# EAGLE design MA_board_1 (EAGLE 9.4.2)
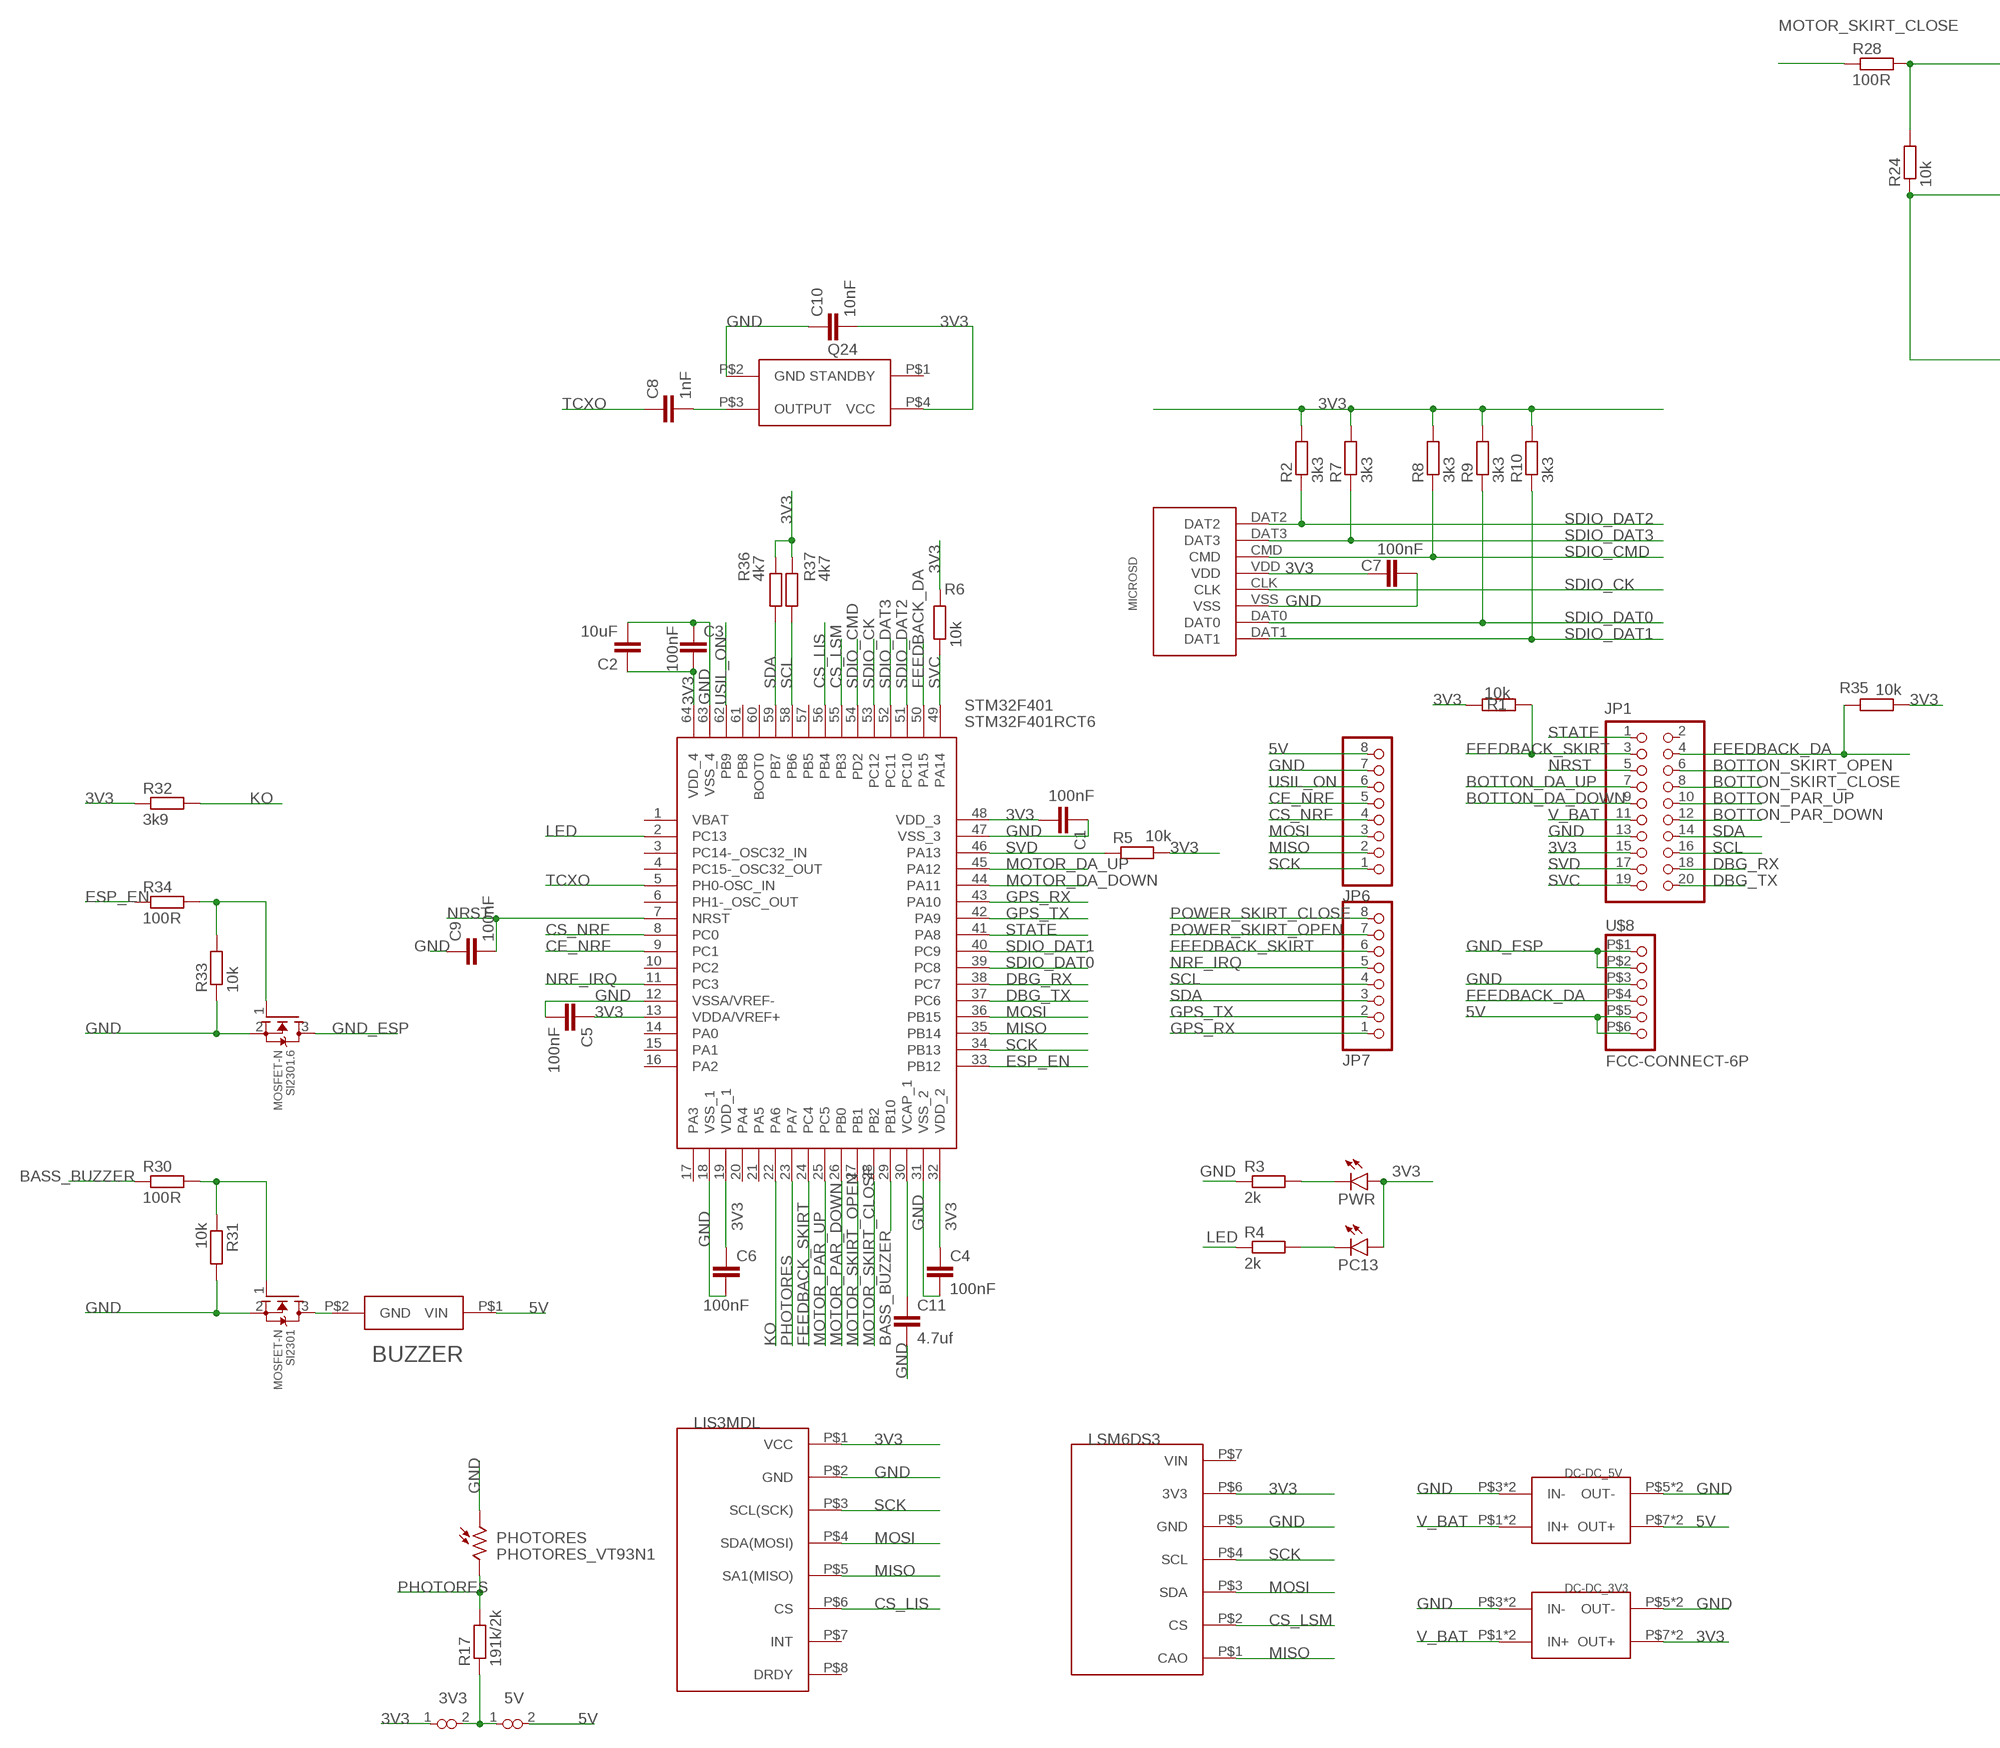
[diagram p0: schematic, sheet 1, part 1 of 2]
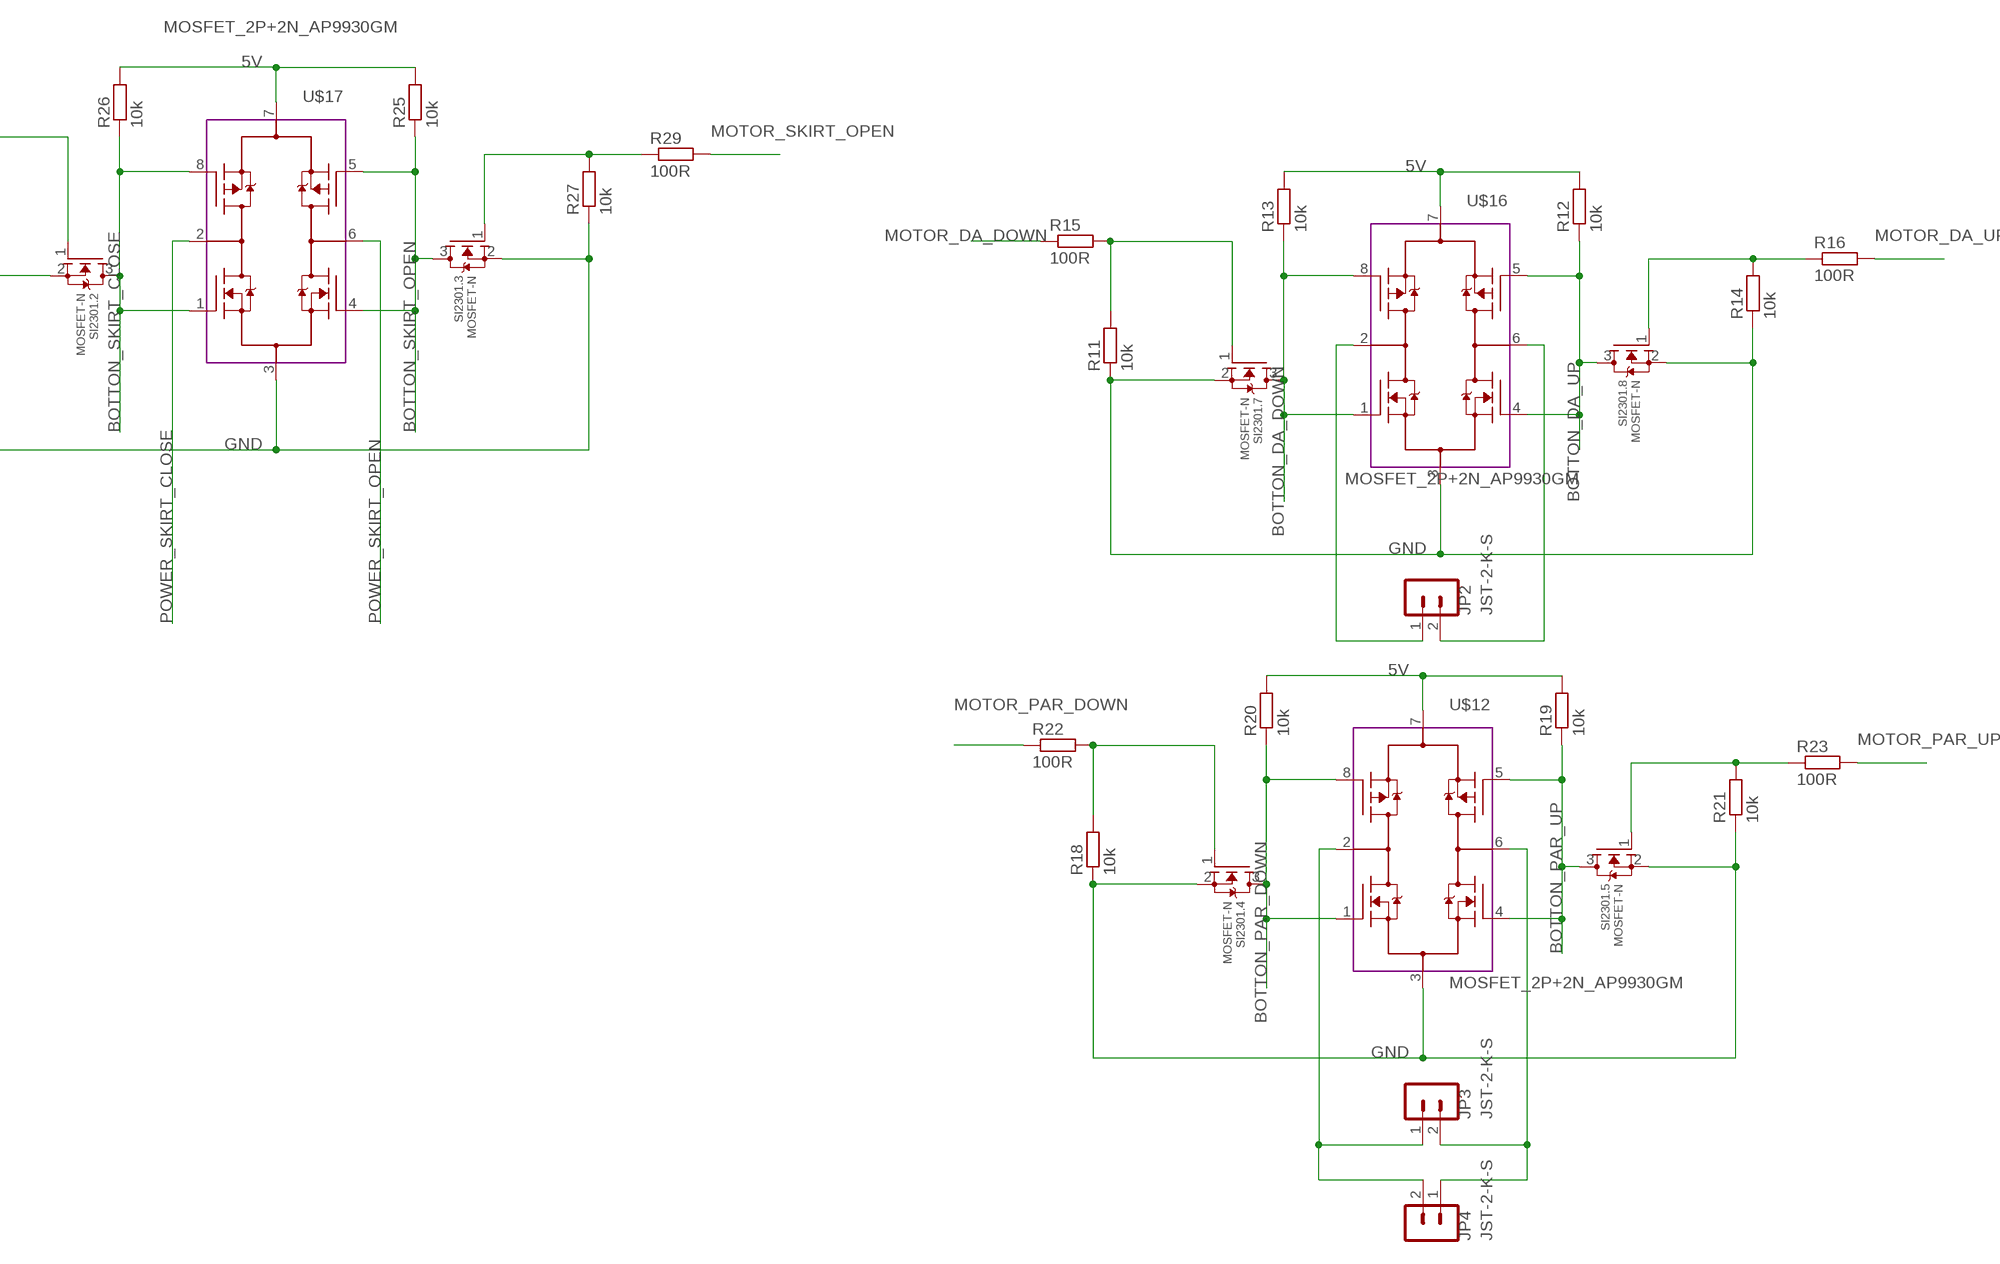
[diagram p1: schematic, sheet 1, part 2 of 2]

## Parts
3V3  VIAS-CONNECT  [VIAS-CONNECT]
5V  VIAS-CONNECT  [VIAS-CONNECT]
BUZZER  BUZZERS8R6  [BUZZER-S8R12]
C1  100nF  C-EUC0603  [C0603]
C2  10uF  C-EUC1206  [C1206]
C3  100nF  C-EUC0603  [C0603]
C4  100nF  C-EUC0603  [C0603]
C5  100nF  C-EUC0603  [C0603]
C6  100nF  C-EUC0603  [C0603]
C7  100nF  C-EUC0603  [C0603]
C8  1nF  C-EUC0603  [C0603]
C9  100nF  C-EUC0603  [C0603]
C10  10nF  C-EUC0603  [C0603]
C11  4.7uf  C-EUC0603  [C0603]
DC-DC_3V3  MP1584-B  [MP1584-B]
DC-DC_5V  MP1584-B  [MP1584-B]
JP1  PINHD-2X10/90  [2X10/90]
JP2  JST-2-K-S  [B2B-PH-K-S]
JP3  JST-2-K-S  [B2B-PH-K-S]
JP4  JST-2-K-S  [B2B-PH-K-S]
JP6  PINHD-1X8-SHORT-PAD  [1X08]
JP7  PINHD-1X8-SHORT-PAD  [1X08]
LIS3MDL  LIS3MDL-CJMCUБез_отв._зеркальный  [LIS3MDL-CGMSU-NB2023]
LSM6DS3  LSM6DS3-GY-NB2023  [LSM6DS3-GY-NB2023]
MICROSD  SD  [SD]
PC13  LEDCHIPLED_0603  [CHIPLED_0603]
PHOTORES  PHOTORES_VT93N1  [PHOTORES_VT93N1_SMD]
PWR  LEDCHIPLED_0603  [CHIPLED_0603]
Q24  Q24  [Q24]
R1  10k  R-EU_R0603  [R0603]
R2  3k3  R-EU_R0603  [R0603]
R3  2k  R-EU_R0603  [R0603]
R4  2k  R-EU_R0603  [R0603]
R5  10k  R-EU_R0603  [R0603]
R6  10k  R-EU_R0603  [R0603]
R7  3k3  R-EU_R0603  [R0603]
R8  3k3  R-EU_R0603  [R0603]
R9  3k3  R-EU_R0603  [R0603]
R10  3k3  R-EU_R0603  [R0603]
R11  10k  R-EU_R0603  [R0603]
R12  10k  R-EU_R0603  [R0603]
R13  10k  R-EU_R0603  [R0603]
R14  10k  R-EU_R0603  [R0603]
R15  100R  R-EU_R0603  [R0603]
R16  100R  R-EU_R0603  [R0603]
R17  191k/2k  R-EU_R0603  [R0603]
R18  10k  R-EU_R0603  [R0603]
R19  10k  R-EU_R0603  [R0603]
R20  10k  R-EU_R0603  [R0603]
R21  10k  R-EU_R0603  [R0603]
R22  100R  R-EU_R0603  [R0603]
R23  100R  R-EU_R0603  [R0603]
R24  10k  R-EU_R0603  [R0603]
R25  10k  R-EU_R0603  [R0603]
R26  10k  R-EU_R0603  [R0603]
R27  10k  R-EU_R0603  [R0603]
R28  100R  R-EU_R0603  [R0603]
R29  100R  R-EU_R0603  [R0603]
R30  100R  R-EU_R0603  [R0603]
R31  10k  R-EU_R0603  [R0603]
R32  3k9  R-EU_R0603  [R0603]
R33  10k  R-EU_R0603  [R0603]
R34  100R  R-EU_R0603  [R0603]
R35  10k  R-EU_R0603  [R0603]
R36  4k7  R-EU_R0603  [R0603]
R37  4k7  R-EU_R0603  [R0603]
SI2301  MOSFET-N  [SOT23-3]
SI2301.2  MOSFET-N  [SOT23-3]
SI2301.3  MOSFET-N  [SOT23-3]
SI2301.4  MOSFET-N  [SOT23-3]
SI2301.5  MOSFET-N  [SOT23-3]
SI2301.6  MOSFET-N  [SOT23-3]
SI2301.7  MOSFET-N  [SOT23-3]
SI2301.8  MOSFET-N  [SOT23-3]
STM32F401  STM32F401RCT6  [QFP50P1200X1200X160-64N]
U$8  FCC-CONNECT-6P  [FFC-CONNECT-6P-SMD]
U$12  MOSFET_2P+2N_AP9930GM  [SO8]
U$16  MOSFET_2P+2N_AP9930GM  [SO8]
U$17  MOSFET_2P+2N_AP9930GM  [SO8]

## Nets
3V3: 3V3.1 C1.2 C2.1 C3.2 C4.1 C5.1 C6.1 C7.2 C10.2 DC-DC_3V3.P$7(OUT+) DC-DC_3V3.P$8(OUT+) JP1.15 LIS3MDL.P$1(VCC) LSM6DS3.P$6(3V3) MICROSD.VDD PC13.A PWR.A Q24.P$4(VCC) R1.2 R2.2 R5.2 R6.2 R7.2 R8.2 R9.2 R10.2 R32.1 R35.1 R36.2 R37.2 STM32F401.13(VDDA/VREF+) STM32F401.19(VDD_1) STM32F401.32(VDD_2) STM32F401.48(VDD_3) STM32F401.64(VDD_4)
5V: 5V.2 BUZZER.P$1(VIN) DC-DC_5V.P$7(OUT+) DC-DC_5V.P$8(OUT+) JP6.8 R12.2 R13.2 R19.2 R20.2 R25.2 R26.2 U$8.P$5 U$8.P$6 U$12.7(P1P2S) U$16.7(P1P2S) U$17.7(P1P2S)
BASS_BUZZER: R30.1 STM32F401.29(PB10)
BOTTON_DA_DOWN: JP1.9 R13.1 SI2301.7.3(D) U$16.1(N1G) U$16.8(P1G)
BOTTON_DA_UP: JP1.7 R12.1 SI2301.8.3(D) U$16.4(N2G) U$16.5(P2G)
BOTTON_PAR_DOWN: JP1.12 R20.1 SI2301.4.3(D) U$12.1(N1G) U$12.8(P1G)
BOTTON_PAR_UP: JP1.10 R19.1 SI2301.5.3(D) U$12.4(N2G) U$12.5(P2G)
BOTTON_SKIRT_CLOSE: JP1.8 R26.1 SI2301.2.3(D) U$17.1(N1G) U$17.8(P1G)
BOTTON_SKIRT_OPEN: JP1.6 R25.1 SI2301.3.3(D) U$17.4(N2G) U$17.5(P2G)
CE_NRF: JP6.5 STM32F401.9(PC1)
CS_LIS: LIS3MDL.P$6(CS) STM32F401.56(PB4)
CS_LSM: LSM6DS3.P$2(CS) STM32F401.55(PB3)
CS_NRF: JP6.4 STM32F401.8(PC0)
DBG_RX: JP1.18 STM32F401.38(PC7)
DBG_TX: JP1.20 STM32F401.37(PC6)
ESP_EN: R34.1 STM32F401.33(PB12)
FEEDBACK_DA: JP1.4 R35.2 STM32F401.50(PA15) U$8.P$4
FEEDBACK_SKIRT: JP1.3 JP7.6 R1.1 STM32F401.24(PC4)
GND: C1.1 C2.2 C3.1 C4.2 C5.2 C6.2 C7.1 C9.1 C10.1 C11.2 DC-DC_3V3.P$3(IN-) DC-DC_3V3.P$4(IN-) DC-DC_3V3.P$5(OUT-) DC-DC_3V3.P$6(OUT-) DC-DC_5V.P$3(IN-) DC-DC_5V.P$4(IN-) DC-DC_5V.P$5(OUT-) DC-DC_5V.P$6(OUT-) JP1.13 JP6.7 LIS3MDL.P$2(GND) LSM6DS3.P$5(GND) MICROSD.VSS PHOTORES.P$1 Q24.P$2(GND) R3.1 R11.1 R14.1 R18.1 R21.1 R24.1 R27.1 R31.2 R33.1 SI2301.2(S) SI2301.2.2(S) SI2301.3.2(S) SI2301.4.2(S) SI2301.5.2(S) SI2301.6.2(S) SI2301.7.2(S) SI2301.8.2(S) STM32F401.12(VSSA/VREF-) STM32F401.18(VSS_1) STM32F401.31(VSS_2) STM32F401.47(VSS_3) STM32F401.63(VSS_4) U$8.P$3 U$12.3(N1N2S) U$16.3(N1N2S) U$17.3(N1N2S)
GND_ESP: SI2301.6.3(D) U$8.P$1 U$8.P$2
GPS_RX: JP7.1 STM32F401.43(PA10)
GPS_TX: JP7.2 STM32F401.42(PA9)
KO: R32.2 STM32F401.22(PA6)
LED: R4.1 STM32F401.2(PC13)
MISO: JP6.2 LIS3MDL.P$5(SA1(MISO)) LSM6DS3.P$1(CAO) STM32F401.35(PB14)
MOSI: JP6.3 LIS3MDL.P$4(SDA(MOSI)) LSM6DS3.P$3(SDA) STM32F401.36(PB15)
MOTOR_DA_DOWN: R15.1 STM32F401.44(PA11)
MOTOR_DA_UP: R16.2 STM32F401.45(PA12)
MOTOR_PAR_DOWN: R22.1 STM32F401.26(PB0)
MOTOR_PAR_UP: R23.2 STM32F401.25(PC5)
MOTOR_SKIRT_CLOSE: R28.1 STM32F401.28(PB2)
MOTOR_SKIRT_OPEN: R29.2 STM32F401.27(PB1)
N$1: R30.2 R31.1 SI2301.1(G)
N$2: R11.2 R15.2 SI2301.7.1(G)
N$3: R18.2 R22.2 SI2301.4.1(G)
N$4: R33.2 R34.2 SI2301.6.1(G)
N$5: JP3.1 JP4.2 U$12.2(P1N1D)
N$6: JP2.1 U$16.2(P1N1D)
N$7: JP2.2 U$16.6(P2N2D)
N$8: R14.2 R16.1 SI2301.8.1(G)
N$9: JP3.2 JP4.1 U$12.6(P2N2D)
N$10: C8.2 Q24.P$3(OUTPUT)
N$11: R21.2 R23.1 SI2301.5.1(G)
N$12: C11.1 STM32F401.30(VCAP_1)
N$13: 3V3.2 5V.1 R17.1
N$14: R24.2 R28.2 SI2301.2.1(G)
N$17: R27.2 R29.1 SI2301.3.1(G)
N$20: BUZZER.P$2(GND) SI2301.3(D)
N$36: PWR.C R3.2
N$37: PC13.C R4.2
NRF_IRQ: JP7.5 STM32F401.11(PC3)
NRST: C9.2 JP1.5 STM32F401.7(NRST)
PHOTORES: PHOTORES.P$2 R17.2 STM32F401.23(PA7)
POWER_SKIRT_CLOSE: JP7.8 U$17.2(P1N1D)
POWER_SKIRT_OPEN: JP7.7 U$17.6(P2N2D)
SCK: JP6.1 LIS3MDL.P$3(SCL(SCK)) LSM6DS3.P$4(SCL) STM32F401.34(PB13)
SCL: JP1.16 JP7.4 R37.1 STM32F401.58(PB6)
SDA: JP1.14 JP7.3 R36.1 STM32F401.59(PB7)
SDIO_CK: MICROSD.CLK STM32F401.53(PC12)
SDIO_CMD: MICROSD.CMD R8.1 STM32F401.54(PD2)
SDIO_DAT0: MICROSD.DAT0 R9.1 STM32F401.39(PC8)
SDIO_DAT1: MICROSD.DAT1 R10.1 STM32F401.40(PC9)
SDIO_DAT2: MICROSD.DAT2 R2.1 STM32F401.51(PC10)
SDIO_DAT3: MICROSD.DAT3 R7.1 STM32F401.52(PC11)
STATE: JP1.1 STM32F401.41(PA8)
SVC: JP1.19 R6.1 STM32F401.49(PA14)
SVD: JP1.17 R5.1 STM32F401.46(PA13)
TCXO: C8.1 STM32F401.5(PH0-OSC_IN)
USIL_ON: JP6.6 STM32F401.62(PB9)
V_BAT: DC-DC_3V3.P$1(IN+) DC-DC_3V3.P$2(IN+) DC-DC_5V.P$1(IN+) DC-DC_5V.P$2(IN+) JP1.11
Unconnected: JP1.2 LIS3MDL.P$7(INT) LIS3MDL.P$8(DRDY) LSM6DS3.P$7(VIN) Q24.P$1(STANDBY) STM32F401.1(VBAT) STM32F401.3(PC14-_OSC32_IN) STM32F401.4(PC15-_OSC32_OUT) STM32F401.6(PH1-_OSC_OUT) STM32F401.10(PC2) STM32F401.14(PA0) STM32F401.15(PA1) STM32F401.16(PA2) STM32F401.17(PA3) STM32F401.20(PA4) STM32F401.21(PA5) STM32F401.57(PB5) STM32F401.60(BOOT0) STM32F401.61(PB8)

## Library data of the parts
3V3 5V = NEON-BLADE-2023:VIAS-CONNECT
BUZZER = NEON-BLADE-2023:BUZZER
C1-C11 = rcl:C-EU: CAPACITOR, European symbol; SPICEPREFIX: C
DC-DC_3V3 DC-DC_5V = NEON-BLADE-2023:MP1584-B
JP1 = pinhead:PINHD-2X10: PIN HEADER
JP2-JP4 = NEON-BLADE-2023:JST-2: JST PH series header 2.00mm pitch disconnectable crimp style connectors, vertical (side entry type), 2 pins
JP6 JP7 = NEON-BLADE-2023:PINHD-1X8-SHORT-PAD: PIN HEADER
LIS3MDL = NEON-BLADE-2023:LIS3MDL-CJMCU
LSM6DS3 = NEON-BLADE-2023:LSM6DS3-GY-NB2023
MICROSD = NEON-BLADE-2023:SD
PC13 PWR = led:LED: LED OSRAM: - CHIPLED LG R971, LG N971, LY N971, LG Q971, LY Q971, LO R971, LY R971 LH N974, LH R974 LS Q976, LO Q976, LY Q976 LO Q996 - Hyper CHIPLED LW Q18S LB Q993, LB Q99A, LB R99A - SideLED LS A670, LO A670, LY A670, LG A670, LP A670 LB A673, LV A673, LT A673, LW A673 LH A674 LY A675 LS A676, LA A676, LO A676, LY A676, LW A676 LS A679, LY A679, LG A679 - Hyper Micro SIDELED® LS Y876, LA Y876, LO Y876, LY Y876 LT Y87S - SmartLED LW L88C, LW L88S LB L89C, LB L89S, LG L890 LS L89K, LO L89K, LY L89K LS L896, LA L896, LO L896, LY L896 - TOPLED LS T670, LO T670, LY T670, LG T670, LP T670 LSG T670, LSP T670, LSY T670, LOP T670, LYG T670 LG T671, LOG T671, LSG T671 LB T673, LV T673, LT T673, LW T673 LH T674 LS T676, LA T676, LO T676, LY T676, LB T676, LH T676, LSB T676, LW T676 LB T67C, LV T67C, LT T67C, LS T67K, LO T67K, LY T67K, LW E67C LS E67B, LA E67B, LO E67B, LY E67B, LB E67C, LV E67C, LT E67C LW T67C LS T679, LY T679, LG T679 LS T770, LO T770, LY T770, LG T770, LP T770 LB T773, LV T773, LT T773, LW T773 LH T774 LS E675, LA E675, LY E675, LS T675 LS T776, LA T776, LO T776, LY T776, LB T776 LHGB T686 LT T68C, LB T68C - Hyper Mini TOPLED® LB M676 - Mini TOPLED Santana® LG M470 LS M47K, LO M47K, LY M47K Source: http://www.osram.convergy.de LUXEON: - LUMILED® LXK2-PW12-R00, LXK2-PW12-S00, LXK2-PW14-U00, LXK2-PW14-V00 LXK2-PM12-R00, LXK2-PM12-S00, LXK2-PM14-U00 LXK2-PE12-Q00, LXK2-PE12-R00, LXK2-PE12-S00, LXK2-PE14-T00, LXK2-PE14-U00 LXK2-PB12-K00, LXK2-PB12-L00, LXK2-PB12-M00, LXK2-PB14-N00, LXK2-PB14-P00, LXK2-PB14-Q00 LXK2-PR12-L00, LXK2-PR12-M00, LXK2-PR14-Q00, LXK2-PR14-R00 LXK2-PD12-Q00, LXK2-PD12-R00, LXK2-PD12-S00 LXK2-PH12-R00, LXK2-PH12-S00 LXK2-PL12-P00, LXK2-PL12-Q00, LXK2-PL12-R00 Source: www.luxeon.com KINGBRIGHT: KA-3528ASYC Source: www.kingbright.com
PHOTORES = NEON-BLADE-2023:PHOTORES_VT93N1
Q24 = CanCubeSat:Q24
R1-R37 = rcl:R-EU_: RESISTOR, European symbol; SPICEPREFIX: R
SI2301 SI2301.2-SI2301.8 = NEON-BLADE-2023:MOSFET-N
STM32F401 = STM32F401RCT6:STM32F401RCT6: 32-Bit MCU Cortex-M4 256KB 1.8V LQFP64 STMicroelectronics STM32F401RCT6, 32bit ARM Cortex M4 MCU, 84MHz, 256 kB Flash, 64-Pin LQFP Source: Datasheet <http://www.st.com/web/en/resource/technical/document/datasheet/DM00086815.pdf>; ARROW_PART_NUMBER: STM32F401RCT6; ARROW_PRICE-STOCK: https://www.arrow.com/en/products/stm32f401rct6/stmicroelectronics?region=nac; DESCRIPTION: 32-Bit MCU Cortex-M4 256KB 1.8V LQFP64 STMicroelectronics STM32F401RCT6, 32bit ARM Cortex M4 MCU, 84MHz, 256 kB Flash, 64-Pin LQFP; HEIGHT: 1.6mm; MANUFACTURER_NAME: STMicroelectronics; MANUFACTURER_PART_NUMBER: STM32F401RCT6; MOUSER_PART_NUMBER: 511-STM32F401RCT6; MOUSER_PRICE-STOCK: https://www.mouser.co.uk/ProductDetail/STMicroelectronics/STM32F401RCT6?qs=DqCdCwOw4%2F4JITyspz8omA%3D%3D
U$8 = NEON-BLADE-2023:FCC-CONNECT-6P
U$12 U$16 U$17 = NEON-BLADE-2023:MOSFET_2P+2N_AP9930GM

## Board
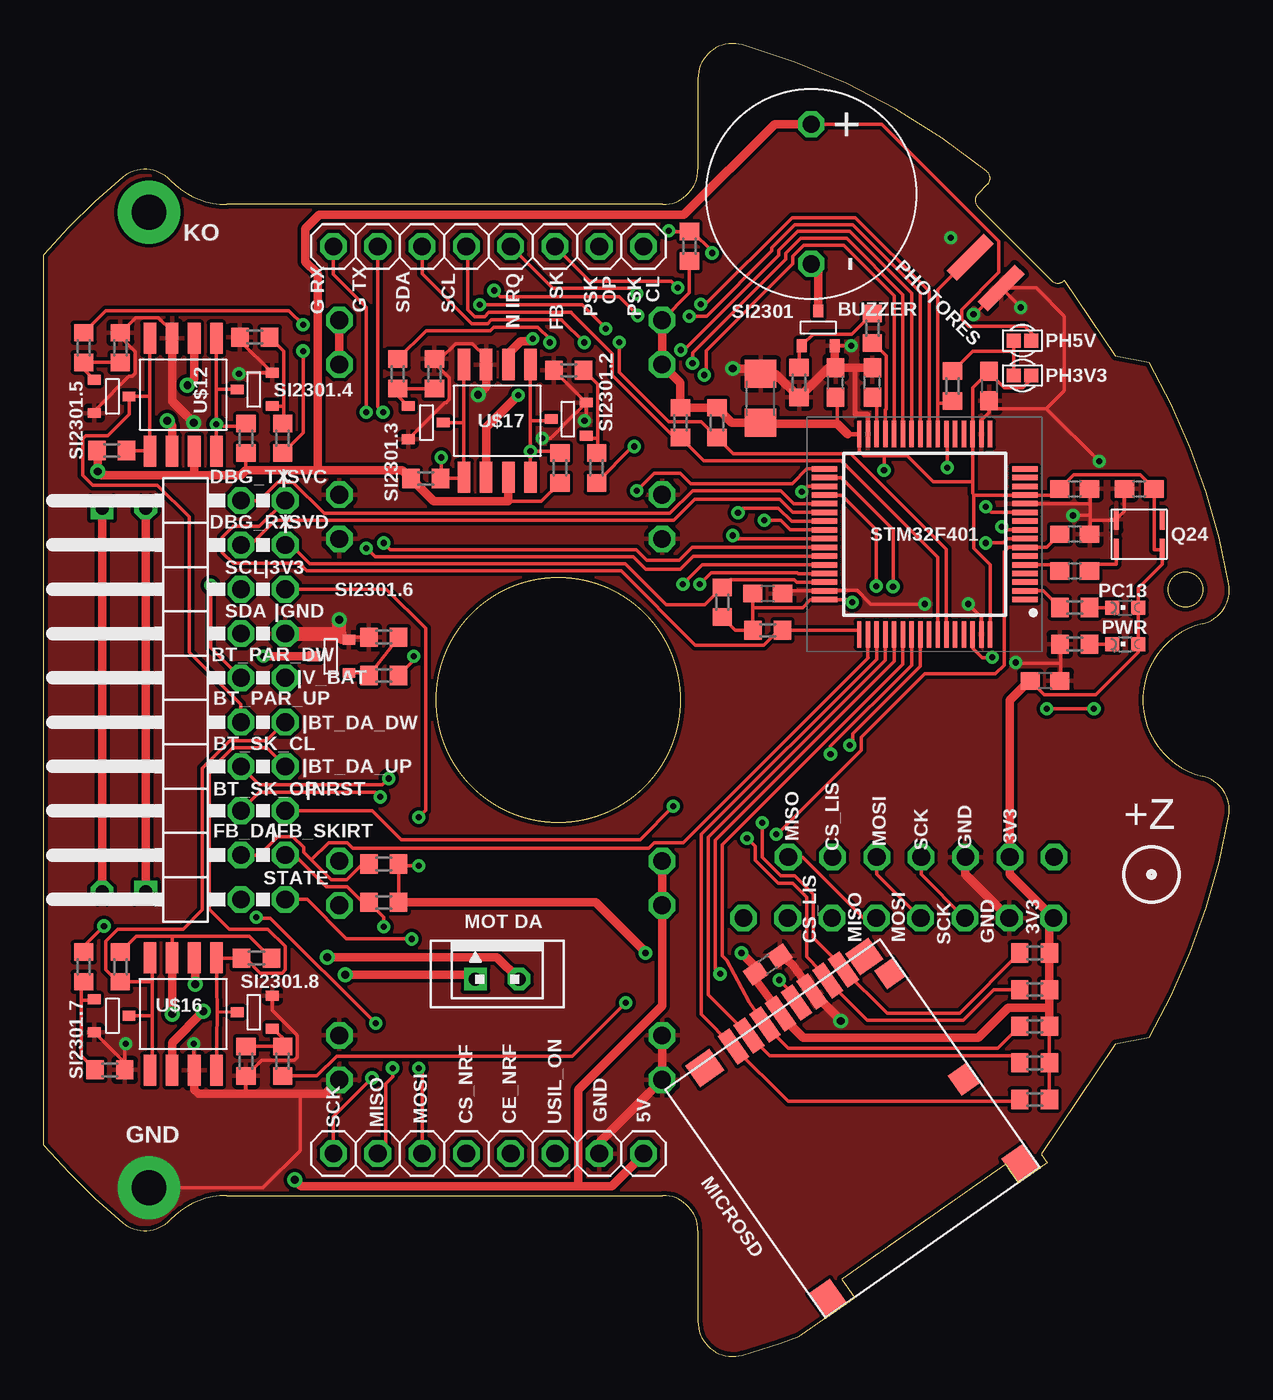
[diagram p2: board, top side]
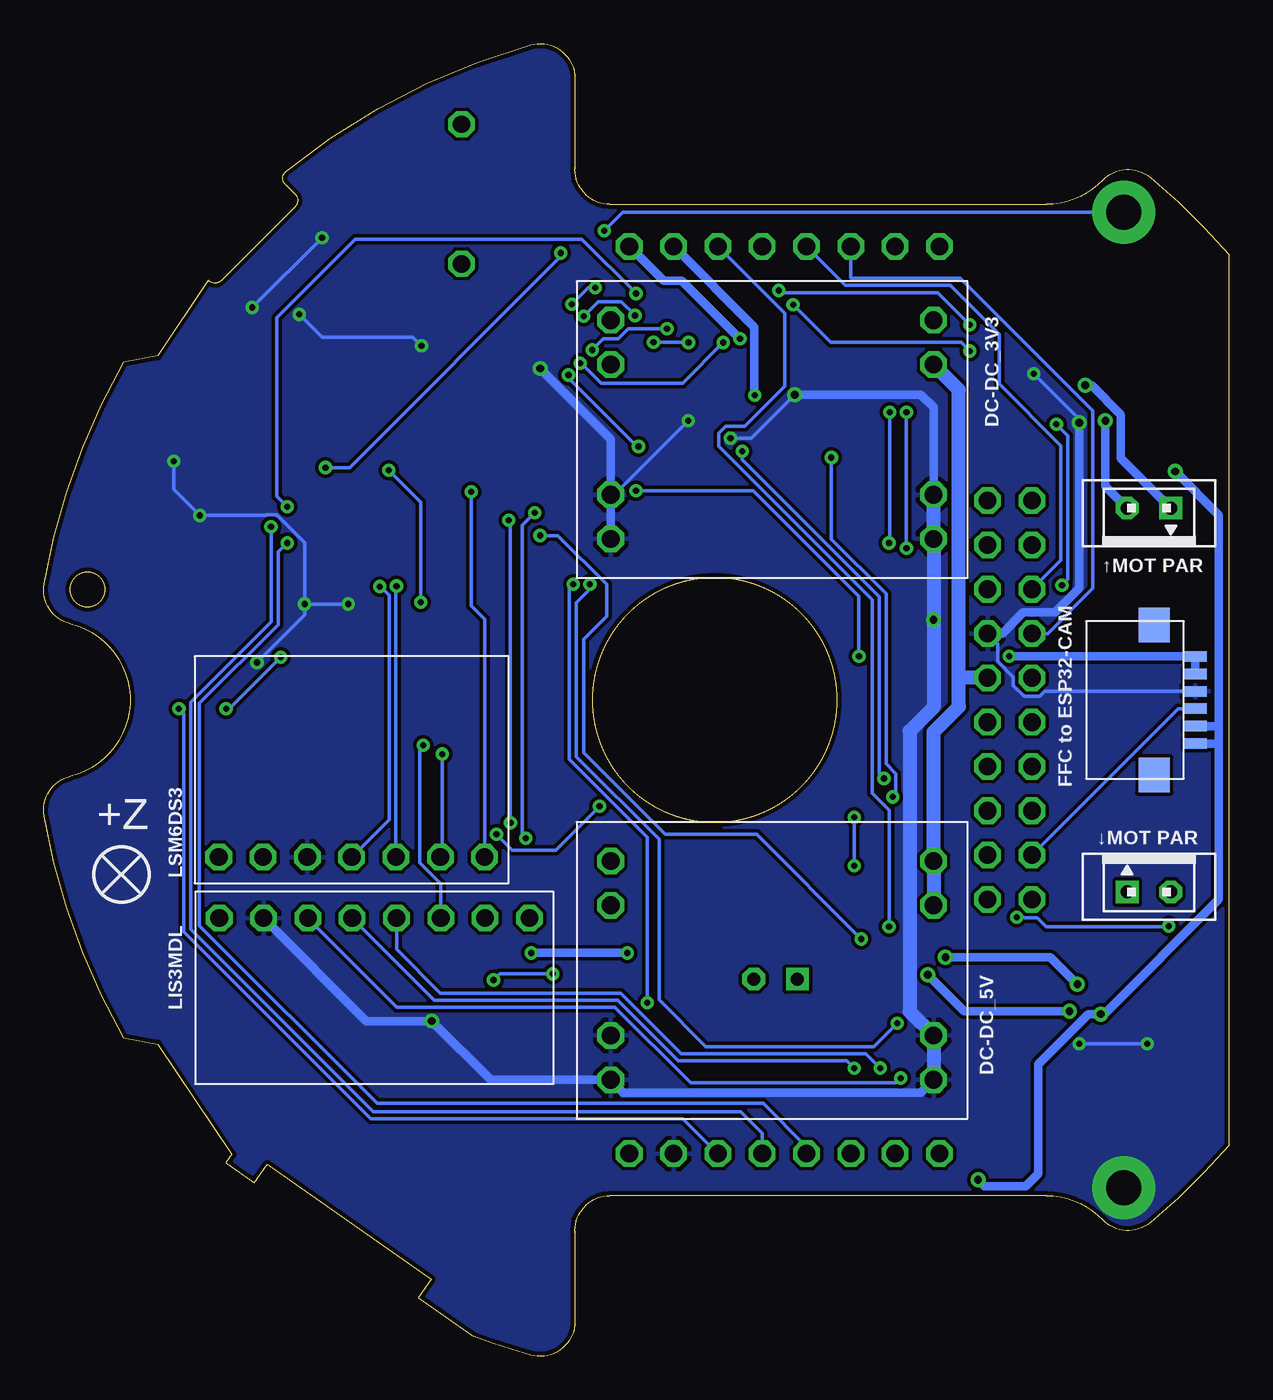
[diagram p3: board, bottom side, seen from below]

Size 67.96 x 75.25 mm. Coordinates in mm from the lower left corner, seen from the top.
Outline: 0,12.11 0,63.13 arc-9 4.52,67.57 arc-86 7.25,67.42 arc46 10.5,66.03 35.5,66.03 arc90 37.5,68.03 37.5,73.25 arc-106 40.04,75.17 arc-23 54.06,67.92 arc-96 54.1,67.17 53.54,66.61 arc90 53.54,65.91 57.78,61.66 arc90 58.49,61.66 58.51,61.68 61.43,57.35 63.36,56.97 arc-20 67.93,44.28 arc-86 66.43,41.99 arc153 66.43,33.25 arc-86 67.93,30.97 arc-20 63.36,18.27 61.43,17.9 57.17,11.58 57.51,11.09 55.88,9.95 55.13,11 45.75,4.43 46.49,3.37 43.32,1.15 arc-5 40.04,0.07 arc-106 37.5,2 37.5,7.21 arc90 35.5,9.21 10.5,9.21 arc46 7.25,7.82 arc-86 4.52,7.67 arc-9 0,12.11
Outline: circle at 29.5,37.62 radius 7
Outline: circle at 65.45,43.96 radius 1
Copper layers (1*16): Top 0.035mm / dielectric 1.5mm / Bottom 0.035mm
Design rules "default *": minimum track width 0.2mm, minimum drill 0.35mm, track to track 0.2mm, track to pad 0.2mm, pad to pad 0.2mm, via to via 0.2mm, smd to smd 0.2mm, copper to edge 0.25mm, drill to drill 6mil, minimum pad ring 10mil, minimum via ring 8mil, stop-mask expansion 4mil, vias tented up to drill 0mil, thermal gap 10mil

### Footprints (pad centres in the part's own frame; a part is rotated, then mirrored left to right if it is on the bottom)
VIAS-CONNECT = smd 0.8 x 0.8: 1 -0.5,0; 2 0.5,0
BUZZER-S8R12 = drill 1 octagon: P$1 -4,0; P$2 4,0
C0603 = smd 1.1 x 1: 1 -0.85,0; 2 0.85,0
C1206 = smd 1.6 x 1.8: 1 -1.4,0; 2 1.4,0
MP1584-B = drill 1.016 octagon: P$1 1.95,2.23; P$2 1.95,4.77; P$3 1.95,12.23; P$4 1.95,14.77; P$5 20.45,14.77; P$6 20.45,12.23; P$7 20.45,4.77; P$8 20.45,2.23
2X10/90 = drill 1.016 octagon: 1 -11.43,-6.35; 2 -11.43,-3.81; 3 -8.89,-6.35; 4 -8.89,-3.81; 5 -6.35,-6.35; 6 -6.35,-3.81; 7 -3.81,-6.35; 8 -3.81,-3.81; 9 -1.27,-6.35; 10 -1.27,-3.81; 11 1.27,-6.35; 12 1.27,-3.81; 13 3.81,-6.35; 14 3.81,-3.81; 15 6.35,-6.35; 16 6.35,-3.81; 17 8.89,-6.35; 18 8.89,-3.81; 19 11.43,-6.35; 20 11.43,-3.81
B2B-PH-K-S = drill 0.75 pad 1.3 square: 1 1.25,0 | drill 0.75 pad 1.3 octagon: 2 -1.25,0
1X08 = drill 1.016 pad 1.524 octagon: 1 -8.89,0; 2 -6.35,0; 3 -3.81,0; 4 -1.27,0; 5 1.27,0; 6 3.81,0; 7 6.35,0; 8 8.89,0
LIS3MDL-CGMSU-NB2023 = drill 1.016 octagon: P$1 -8.89,-4; P$2 -6.35,-4; P$3 -3.81,-4; P$4 -1.27,-4; P$5 1.27,-4; P$6 3.81,-4; P$7 6.35,-4; P$8 8.89,-4
LSM6DS3-GY-NB2023 = drill 1.016 octagon: P$1 -7.62,-5; P$2 -5.08,-5; P$3 -2.54,-5; P$4 0,-5; P$5 2.54,-5; P$6 5.08,-5; P$7 7.62,-5
SD = smd 0.8 x 2: CLK 6,-15.77; CMD 8.2,-15.77; DAT0 3.8,-15.77; DAT1 2.7,-15.77; DAT2 10.4,-15.77; DAT3 9.3,-15.77; VDD 7.1,-15.77; VSS 4.9,-15.77 | smd 1.5 x 1.7: P$9 0.75,-0.85; P$13 14.25,-0.85 | smd 1.6 x 1.5: P$10 1.3,-15.7 | smd 1.29 x 1.3: P$11 0.645,-14.05 | smd 1.29 x 1.4: P$12 0.645,-6.65 | smd 1.7 x 1.5: P$14 12.45,-15.7
CHIPLED_0603 = smd 0.8 x 0.8: A 0,-0.75; C 0,0.75
PHOTORES_VT93N1_SMD = smd 0.8 x 3: P$1 -1.25,0; P$2 1.25,0
Q24 = smd 0.3 x 1.2: P$1 -1.325,-0.85; P$2 1.325,-0.85; P$3 1.325,0.85; P$4 -1.325,0.85
R0603 = smd 1 x 1.1: 1 -0.85,0; 2 0.85,0
SOT23-3 = smd 0.56 x 0.73: 1 -0.95,-1; 2 0.95,-1; 3 0,1
QFP50P1200X1200X160-64N = smd 1.475 x 0.27: 1 -5.738,3.75; 2 -5.738,3.25; 3 -5.738,2.75; 4 -5.738,2.25; 5 -5.738,1.75; 6 -5.738,1.25; 7 -5.738,0.75; 8 -5.738,0.25; 9 -5.738,-0.25; 10 -5.738,-0.75; 11 -5.738,-1.25; 12 -5.738,-1.75; 13 -5.738,-2.25; 14 -5.738,-2.75; 15 -5.738,-3.25; 16 -5.738,-3.75; 33 5.738,-3.75; 34 5.738,-3.25; 35 5.738,-2.75; 36 5.738,-2.25; 37 5.738,-1.75; 38 5.738,-1.25; 39 5.738,-0.75; 40 5.738,-0.25; 41 5.738,0.25; 42 5.738,0.75; 43 5.738,1.25; 44 5.738,1.75; 45 5.738,2.25; 46 5.738,2.75; 47 5.738,3.25; 48 5.738,3.75 | smd 0.27 x 1.475: 17 -3.75,-5.738; 18 -3.25,-5.738; 19 -2.75,-5.738; 20 -2.25,-5.738; 21 -1.75,-5.738; 22 -1.25,-5.738; 23 -0.75,-5.738; 24 -0.25,-5.738; 25 0.25,-5.738; 26 0.75,-5.738; 27 1.25,-5.738; 28 1.75,-5.738; 29 2.25,-5.738; 30 2.75,-5.738; 31 3.25,-5.738; 32 3.75,-5.738; 49 3.75,5.738; 50 3.25,5.738; 51 2.75,5.738; 52 2.25,5.738; 53 1.75,5.738; 54 1.25,5.738; 55 0.75,5.738; 56 0.25,5.738; 57 -0.25,5.738; 58 -0.75,5.738; 59 -1.25,5.738; 60 -1.75,5.738; 61 -2.25,5.738; 62 -2.75,5.738; 63 -3.25,5.738; 64 -3.75,5.738
FFC-CONNECT-6P-SMD = smd 0.6 x 1.3: P$1 -7,0.65; P$2 -6,0.65; P$3 -5,0.65; P$4 -4,0.65; P$5 -3,0.65; P$6 -2,0.65 | smd 2 x 1.8: P$16 -0.2,-1.7; P$17 -8.8,-1.7
SO8 = smd 0.72 x 1.78: 1 -1.905,-3.23; 2 -0.635,-3.23; 3 0.635,-3.23; 4 1.905,-3.23; 5 1.905,3.23; 6 0.635,3.23; 7 -0.635,3.23; 8 -1.905,3.23

### Placement (x,y rotation side)
3V3  56.1,56.22 180 top
5V  56.1,58.22 0 top
BUZZER  44,66.62 270 top
C1  41.5,43.72 180 top
C2  41.1,54.92 90 top
C3  57.4,38.72 180 top
C4  45.4,55.82 90 top
C5  59.1,49.72 0 top
C6  54.2,55.62 270 top
C7  41.5,22.46 215 top
C8  59.1,45.02 0 top
C9  59.1,47.12 180 top
C10  62.8,49.72 0 top
C11  47.5,55.82 90 top
DC-DC_3V3  15,61.62 180 bottom
DC-DC_5V  15,30.62 180 bottom
JP1  7.5,37.62 90 top
JP2  26,21.62 180 top
JP3  4.6,48.62 0 bottom
JP4  4.6,26.62 180 bottom
JP6  25.5,11.62 0 top
JP7  25.5,63.62 0 top
LIS3MDL  49,21.12 180 top
LSM6DS3  50.3,33.62 0 top
MICROSD  57.1,10.81 215 top
PC13  62,42.92 90 top
PHOTORES  54,62.12 135 top
PWR  62,40.82 90 top
Q24  62.8,47.12 180 top
R1  19.5,26.02 0 top
R2  56.8,14.72 0 top
R3  59.1,40.82 0 top
R4  59.1,42.92 0 top
R5  38.9,43.22 270 top
R6  41.5,41.62 180 top
R7  56.8,16.82 0 top
R8  56.8,18.92 0 top
R9  56.8,21.02 0 top
R10  56.8,23.12 0 top
R11  3.8,16.42 180 top
R12  12.2,22.82 0 top
R13  4.4,22.32 90 top
R14  11.6,16.92 90 top
R15  2.3,22.32 270 top
R16  13.7,16.92 270 top
R17  52.1,55.62 270 top
R18  12.1,58.42 0 top
R19  3.9,51.92 180 top
R20  11.6,52.62 270 top
R21  4.4,57.82 270 top
R22  13.7,52.62 90 top
R23  2.3,57.82 90 top
R24  30.1,56.52 0 top
R25  21.9,50.32 180 top
R26  29.6,50.92 270 top
R27  22.4,56.32 270 top
R28  31.7,50.92 90 top
R29  20.3,56.32 90 top
R30  47.5,58.92 90 top
R31  43.3,55.82 270 top
R32  37.02,63.62 90 top
R33  19.5,41.22 0 top
R34  19.5,39.02 180 top
R35  19.5,28.22 180 top
R36  38.6,53.52 90 top
R37  36.5,53.52 90 top
SI2301  44.4,58.92 0 top
SI2301.2  30.1,53.72 90 top
SI2301.3  21.9,53.52 270 top
SI2301.4  12.1,55.42 90 top
SI2301.5  3.9,55.02 270 top
SI2301.6  16.5,40.12 90 top
SI2301.7  3.9,19.52 270 top
SI2301.8  12.1,19.72 90 top
STM32F401  50.5,47.12 180 top
U$8  2.6,33.12 270 bottom
U$12  8,55.12 180 top
U$16  8,19.62 0 top
U$17  26,53.62 180 top

### Tracks (layer width: path | path; a pad name or v marks a point on that pad's centre or on a via)
3V3  (via drill 0.35)
  Top 0.2: R8.2 R7.2 R2.2 | R35.1 20.35,28.12 | 20.35,28.12 R1.2 | STM32F401.64 54.25,45.37 53.3,46.32 53.3,49.32 53.35,49.37 | 53.35,49.37 STM32F401.13 57.9,49.37 C5.1 59.05,50.52 62.85,50.52 C10.2 63.65,46.25 64.1,46.25 Q24.P$4 64.12,45.4 62.75,44.02 PC13.A PWR.A 62.75,40.37 60.3,37.92 57.35,37.92 C3.2 | 53.25,50.12 STM32F401.19 53.25,55.52 C6.1 54.2,56.4 55.08,55.52 56.12,55.52 56.6,56 3V3.1 | C1.2 40.65,42.92 | 40.65,42.92 R6.2 39.65,41.62 R5.2 | 40.65,42.92 43.5,42.92 43.95,43.37 STM32F401.48 46.2,43.37 v46.35,43.23 | C4.1 45.5,54.87 45.5,53.46 | R32.1 37.02,60.96 DC-DC_3V3.P$8 | STM32F401.32 46.75,51.87 47,51.62 48.2,51.62 | 48.2,51.62 49.5,51.62 51,50.12 53.25,50.12 | v48.17,50.79 48.17,51.59 48.2,51.62 | 40.87,22.12 40.87,21.5 | JP1.15 19.65,43.97 21.9,41.72 21.9,31.3 v21.5,30.9 | v21.5,28.12 20.35,28.12 | 53.35,49.37 53.25,49.47 53.25,50.12
  Top 0.27: 46.1,52.86 STM32F401.32
  Top 0.5: 57.65,19.97 R8.2 | 57.65,19.97 55.28,19.97 53.59,18.28 43.55,18.28 42.24,19.58 MICROSD.VDD 40.87,21.5 C7.2 | 57.65,19.97 R9.2 R10.2 57.65,24.88 LIS3MDL.P$1 55.38,27.63 LSM6DS3.P$6 55.38,37.6 56.5,38.72 C3.2 | DC-DC_3V3.P$8 DC-DC_3V3.P$7 36.5,55.8 R37.2 R36.2 39.45,53.52 C2.1 41.16,53.46 45.5,53.46 46.1,52.86 | v34.5,23.12 34.5,23.17 31.65,26.02 R1.2 | v40,23.12 40.87,22.25 40.87,22.12
  Bottom 0.2: v46.35,43.23 46.35,48.97 v48.17,50.79 | v21.5,30.9 v21.5,28.12
  Bottom 0.5: v34.5,23.12 v40,23.12
5V  (via drill 0.45)
  Top 0.2: R13.2 5.32,24.09 7.37,24.09 | 7.37,24.09 11.78,24.09 R12.2 | 21.12,50.25 R25.2 | 26.64,49 28.53,49 R26.2 | U$16.7 7.37,24.09 | R20.2 11.6,50.8 | BUZZER.P$1 48.05,70.62 54.76,63.91 54.76,62.14 52.62,60 52.62,59.44 53.02,59.04 56.25,59.04 56.72,58.57 56.72,58.34 5V.2
  Top 0.5: DC-DC_5V.P$8 DC-DC_5V.P$7 35.45,20.11 30.64,15.29 30.64,9.75 | 30.64,9.75 32.55,9.75 34.39,11.59 JP6.8 | v14.4,10.11 14.76,9.75 30.64,9.75 | U$17.7 26.64,49 22.37,49 21.12,50.25 20.57,50.8 15.7,50.8 | U$12.7 8.63,50.5 | U$16.7 v7.37,19.63 v7.37,19.62 | R19.2 3.1,51.87 v3.1,50.72 3.32,50.5 8.63,50.5 | 15.7,50.8 11.6,50.8 11.3,50.5 8.63,50.5 | BUZZER.P$1 41.9,70.62 36.7,65.42 15.8,65.42 15,64.62 15,62.76 15.7,62.06 15.7,50.8
  Bottom 0.5: v14.4,10.11 14.03,9.75 11.67,9.75 10.96,10.46 10.96,16.74 8.07,19.62 v7.37,19.62 7.17,19.62 0.6,26.19 0.6,35.12 | v3.1,50.72 0.6,48.22 0.6,36.12 | 0.6,35.12 0.6,36.12 | U$8.P$6 0.6,35.12 | U$8.P$5 0.6,36.12
BASS_BUZZER
  Top 0.2: STM32F401.29 48.25,54.25 48.3,54.3 48.3,57.35 47.57,58.07 R30.1
BOTTON_DA_DOWN
  Top 0.2: 6.24,21.47 6.24,22.8 U$16.8 | 6.24,21.47 6.24,19.52 | 6.24,19.52 6.24,16.54 U$16.1 | SI2301.7.3 6.24,19.52 | 6.24,21.47 R13.1 4.23,21.47 3.55,22.15 3.55,23.8 4.25,24.49 8,24.49 9.1,25.59 9.1,33.7 10.67,35.27 12.77,35.27 JP1.9
BOTTON_DA_UP
  Top 0.2: 9.95,19.76 U$16.5 9.94,22.82 R12.1 11.58,22.82 12.43,21.97 13.67,21.97 13.85,22.15 13.85,23.5 12.85,24.49 10.63,24.49 9.5,25.62 9.5,33.54 10.84,34.87 12.79,34.87 JP1.7 | 9.95,19.76 9.95,19.75 U$16.4 | SI2301.8.3 9.95,19.76
BOTTON_PAR_DOWN  (via drill 0.35)
  Top 0.2: U$12.1 9.9,55.42 | 9.9,55.42 v9.9,53.42 9.9,53.32 | 9.9,53.32 U$12.8 | SI2301.4.3 9.9,55.42 | R20.1 11.6,53.32 9.9,53.32 | v9.59,44.21 9.59,40.62 JP1.12
  Bottom 0.2: v9.9,53.42 9.25,52.77 9.25,44.54 v9.59,44.21
BOTTON_PAR_UP
  Top 0.2: 6.09,55.02 U$12.5 6.09,51.92 R19.1 | 6.09,55.02 U$12.4 | 6.09,55.02 SI2301.5.3 4.9,54 3.67,52.77 2.43,52.77 2.25,52.6 2.25,50.51 2.82,49.94 6.53,49.94 8.35,48.12 8.35,40.35 11.31,37.39 JP1.10
BOTTON_SKIRT_CLOSE  (via drill 0.35)
  Top 0.2: U$17.1 27.91,53.62 | 27.91,53.62 v27.91,51.87 | v27.91,51.87 U$17.8 | SI2301.2.3 29.1,53.62 27.91,53.62 | R26.1 29.5,51.87 v27.91,51.87 | JP1.8 12.37,32.75 19.42,32.75 v19.79,33.12
  Bottom 0.2: v19.79,33.12 20.07,33.4 20.07,43.54 27.91,51.38 v27.91,51.87
BOTTON_SKIRT_OPEN  (via drill 0.35)
  Top 0.2: U$17.4 24.09,53.52 | 24.09,53.52 U$17.5 24.09,50.32 R25.1 22.8,50.37 v22.8,51.52 | SI2301.3.3 24.09,53.52 | JP1.6 12.37,32.33 19.02,32.33 v19.29,32.07
  Bottom 0.2: v19.29,32.07 19.11,32.24 19.11,33.4 19.67,33.96 19.67,43.71 22.8,46.84 v22.8,51.52
CE_NRF  (via drill 0.35)
  Top 0.2: STM32F401.9 55.1,47.37 v54.92,47.55
  Bottom 0.2: JP6.5 26.77,12.79 28,14.02 49.05,14.02 59.52,24.5 59.52,37.5 54.92,42.1 v54.92,47.55
CS_LIS  (via drill 0.35)
  Top 0.2: STM32F401.56 50.25,39.54 46.38,35.68 46.38,35.2 v46.2,35.02
  Bottom 0.2: v46.2,35.02 46.4,34.82 46.4,28.3 45.19,27.09 LIS3MDL.P$6
CS_LSM  (via drill 0.35)
  Top 0.2: STM32F401.55 49.75,39.61 45.1,34.96 v45.1,34.52
  Bottom 0.2: v45.1,34.52 45.1,28.74 LSM6DS3.P$2
CS_NRF  (via drill 0.35)
  Top 0.2: v54,46.62 55,46.62 55.25,46.87 STM32F401.8
  Bottom 0.2: JP6.4 24.23,12.02 26.71,14.51 48.84,14.51 59.02,24.69 59.02,37.43 54.52,41.93 54.52,42.6 54.5,42.62 54.5,46.12 v54,46.62
DBG_RX
  Top 0.2: STM32F401.38 42.93,48.37 42.18,49.12 37.32,49.12 36.11,47.91 13.28,47.91 11.88,46.51 JP1.18
DBG_TX
  Top 0.2: STM32F401.37 43,48.87 42.25,49.62 37.2,49.62 35.89,48.31 16.09,48.31 14.29,50.11 13.41,50.11 12.35,49.05 JP1.20
ESP_EN  (via drill 0.35)
  Top 0.2: R34.1 21.22,39.89 v21.22,40.12 | v34,49.62 35,50.62 36.5,50.62 37.1,50.02 42.9,50.02 43.75,50.87 STM32F401.33
  Bottom 0.2: v34,49.62 27.28,49.62 21.22,43.56 v21.22,40.12
FEEDBACK_DA
  Top 0.2: R35.2 18.28,28.22 17.37,27.31 16.5,27.31 15.35,28.47 | JP1.4 12.35,28.73 13.41,29.79 14.29,29.79 14.91,29.17 14.91,28.9 15.35,28.47 | 15.35,28.47 16.33,29.45 17.39,29.45 17.72,29.12 34.68,29.12 35.01,29.45 36.67,29.45 47.27,40.06 47.25,40.07 STM32F401.50
  Bottom 0.2: U$8.P$4 2.92,37.12 JP1.4
FEEDBACK_SKIRT  (via drill 0.35)
  Top 0.2: JP1.3 14.39,28.73 16.21,26.91 17.39,26.91 18.28,26.02 R1.1 19.5,25.17 v19.5,24.62 | v37.67,60.3 37.92,60.3 42.9,65.28 46.53,65.28 50.75,61.06 STM32F401.24 | JP7.6 31.31,61.62 35.96,61.62 v36.34,61.24
  Bottom 0.2: v19.5,24.62 19.5,31.32 20.47,32.29 20.47,43.38 29.26,52.17 29.26,52.9 28.86,53.3 27.78,53.3 25.48,55.6 25.48,59.79 JP7.6 | v36.34,61.24 36.73,61.24 v37.67,60.3
GND  (via drill 0.35, 0.45, 2 pad 3.6)
  Top 0.2: C10.1 61.95,48.45 Q24.P$2 61.42,47.92 60,47.92 | 60,48.87 60,48.2 | 60,48.2 60,47.92 | 60,47.92 60,47.17 C9.1 | PHOTORES.P$1 53.37,59.72 v53.3,59.72 | 60,48.87 STM32F401.12 | 57.48,54.32 v60.5,51.3 | v53,43.12 53.75,42.37 STM32F401.63 | SI2301.7.2 4.65,16.82 R11.1 4.65,17.87 v4.7,17.92 | R18.1 11.25,58.22 SI2301.4.2 11.25,56.37 v11.2,56.32 | SI2301.2.2 R24.1 | U$12.3 7.37,58.76 6.58,59.54 5.27,59.54 R21.1 4.4,58.45 5.25,57.6 5.25,56.35 5.07,56.17 4.88,56.17 2.98,54.27 2.98,54.15 SI2301.5.2 | U$17.3 25.36,57.26 24.58,58.04 23.61,58.04 22.74,57.17 R27.1 22.4,56.95 23.25,56.1 23.25,54.85 23.07,54.67 22.98,54.67 22.23,53.93 22.23,53.91 SI2301.3.2 | U$16.3 8.63,16.8 8.6,16.83 v8.6,17.92 | SI2301.6.2 17.65,41.22 R33.1 | 14.7,15.05 14.7,11.79 12.57,9.66 v6.04,9.66 | SI2301.2.2 29.77,53.34 29.77,53.32 29.07,52.62 v28.58,52.62 | C5.2 60,49.67 60,48.87 | C1.1 42.5,43.87 STM32F401.47 44.8,43.91 46.63,43.91 47.41,43.12 v50.5,43.12 | v55.73,39.77 55.77,39.72 58.3,39.72 | 58.3,39.72 58.3,40.77 R3.1 | 58.3,39.72 58.3,38.77 C3.1 | SI2301.2 v46.3,57.92 | SI2301.8.2 13.1,19.85 14.55,18.4 14.55,17.15 14.37,16.97 12.5,16.97 R14.1 11.6,15.15 11.5,15.05 | v59,48.2 60,48.2 | SI2301.2.2 31.1,53.73 v31,53.63 | STM32F401.18 53.75,53.65 54.2,54.1 C6.2 54.65,54.32 57.48,54.32 | PHOTORES.P$1 56.88,61.24 58.5,59.62 58.5,55.34 57.48,54.32 | PHOTORES.P$1 v56,60.12 | v56,60.12
  Top 0.27: STM32F401.31 47.25,54
  Top 0.3: 47.25,54 46.52,54 46.5,54.02 46.5,56.67
  Top 0.5: LIS3MDL.P$2 52.84,27.63 LSM6DS3.P$5 | C7.1 42.91,22.49 MICROSD.VSS 45.55,19.41 v45.7,19.22 | DC-DC_5V.P$6 DC-DC_5V.P$5 31.85,12.25 JP6.7 | DC-DC_5V.P$4 16.15,15.05 14.7,15.05 11.5,15.05 8.88,15.05 8.63,15.3 U$16.3 | U$12.3 7.37,54.76 v8.6,53.52 | U$17.3 25.36,55.59 v24.9,55.12 | v16.95,42.22 17.05,42.12 17.05,41.07 SI2301.6.2 | v39.5,56.62 40.8,56.62 C2.2 41.95,56.32 R31.2 45,56.67 C4.2 | C4.2 46.5,56.67 C11.2 | C4.2 45.35,56.72 SI2301.2
  Top 0.8: JP1.13 16.95,41.43 v16.95,42.22
  Bottom 0.2: v60.5,51.3 60.5,49.7 v59,48.2 55.23,48.2 55.2,48.23 54.61,48.23 53,46.62 v53,43.12 | v8.6,17.92 v4.7,17.92 | JP1.13 13.28,40.86 13.28,39.84 12.37,38.94 12.37,38.45 11.75,37.83 10.87,37.83 10.58,38.12 U$8.P$3 | v11.2,56.32 8.6,53.72 v8.6,53.52 | v24.9,55.12 27.4,52.62 v28.58,52.62 | v53,43.12 53,42.5 v55.73,39.77 | v50.5,43.12 v53,43.12 | v46.3,57.92 46.8,58.42 52,58.42 v53.3,59.72 | v31,53.63 35.24,49.39 DC-DC_3V3.P$6 | v56,60.12 v52,64.12
  Bottom 0.5: LIS3MDL.P$2 49.45,19.22 v45.7,19.22 42.33,15.85 DC-DC_5V.P$5 34.72,15.12 17.68,15.12 DC-DC_5V.P$4 | v8.6,53.52 8.6,44.02 9.98,42.64 11.81,42.64 13.02,41.43 JP1.13 | v24.9,55.12 17.68,55.12 16.95,54.39 DC-DC_3V3.P$3 | DC-DC_3V3.P$5 DC-DC_3V3.P$6 35.45,52.57 v39.5,56.62
  Bottom 0.8: DC-DC_5V.P$4 DC-DC_5V.P$3 18.31,19.75 18.31,35.84 16.95,37.21 v16.95,42.22 DC-DC_3V3.P$4 DC-DC_3V3.P$3
  pour Top: -0.2,75.32 68.2,75.32 68.2,-0.08 -0.2,-0.08
  pour Bottom: -0.5,75.62 68.5,75.62 68.5,-0.38 -0.5,-0.38
GND_ESP  (via drill 0.35)
  Top 0.5: SI2301.6.3 v12.6,40.12
  Bottom 0.5: U$8.P$2 U$8.P$1 v12.6,40.12
GPS_RX  (via drill 0.35)
  Top 0.2: STM32F401.43 37.25,45.87 36.5,45.12 34.5,45.12 33.8,45.83 19,45.83 v18.5,46.32 | v18.5,54.12 18.5,60.12 16.61,62.01 JP7.1
  Bottom 0.2: v18.5,46.32 v18.5,54.12
GPS_TX  (via drill 0.35)
  Top 0.2: JP7.2 19.15,54.43 19.18,54.4 v19.46,54.12 | STM32F401.42 37.18,46.37 36.43,45.62 34.57,45.62 33.96,46.23 19.87,46.23 v19.5,46.62
  Bottom 0.2: v19.46,54.12 19.46,46.65 v19.5,46.62
KO  (via drill 0.35, 2 pad 3.6)
  Top 0.2: v35.83,64.52 35.88,64.47 R32.2 37.18,64.47 38.31,63.34 v38.31,63.24 | STM32F401.22 51.8,52.81 v51.8,50.94
  Bottom 0.2: v35.83,64.52 34.77,65.58 v6.04,65.58 | v51.8,50.94 50.41,50.94 38.31,63.04 v38.31,63.24
LED
  Top 0.2: R4.1 57.3,43.87 STM32F401.2
MISO  (via drill 0.35)
  Top 0.2: v43.45,49.55 43.77,49.87 STM32F401.35 | JP6.2 19.6,12.07 19.6,15.62 20,16.02 v20,16.52 | LSM6DS3.P$1 43.5,28.62 47,25.12 LIS3MDL.P$5
  Bottom 0.2: v43.45,49.55 43.45,43.03 42.68,42.26 LSM6DS3.P$1 | LIS3MDL.P$5 47.73,23.32 45.23,20.82 34.88,20.82 31.41,17.35 20.83,17.35 v20,16.52
MOSI  (via drill 0.35)
  Top 0.2: LIS3MDL.P$4 47.76,27.63 LSM6DS3.P$3 | STM32F401.36 45.75,49.37 47.73,47.39 v47.73,44.15 | v21.5,16.52 21.69,16.33 JP6.3
  Bottom 0.2: LSM6DS3.P$3 47.76,44.12 v47.73,44.15 | LIS3MDL.P$4 45.57,20.42 35.05,20.42 31.57,16.95 21.93,16.95 v21.5,16.52
MOTOR_DA_DOWN  (via drill 0.35)
  Top 0.2: v36.64,44.25 36.92,44.53 37.76,45.37 STM32F401.44 | v19.03,19.09 13,25.12 12.23,25.12 v12.18,25.17 | v3.46,24.66 2.3,23.51 R15.1
  Bottom 0.2: v36.64,44.25 36.64,43.98 37.42,43.2 37.42,34.38 32.68,29.64 32.68,20.43 30,17.75 20.37,17.75 v19.03,19.09 | v12.18,25.17 11.79,25.17 11.75,25.13 11.01,25.13 10.5,24.62 3.5,24.62 v3.46,24.66
MOTOR_DA_UP  (via drill 0.35)
  Top 0.2: STM32F401.45 43.24,44.87 43.19,44.92 38.28,44.92 v37.6,44.25 | v33.36,20.26 30.31,17.21 16.81,17.21 15.67,16.07 R16.2
  Bottom 0.2: v33.36,20.26 33.36,29.75 37.82,34.22 37.82,44.03 v37.6,44.25
MOTOR_PAR_DOWN  (via drill 0.35)
  Top 0.2: STM32F401.26 49.75,60.93 46.2,64.48 43.23,64.48 42.15,63.39 42.15,63.12 36.71,57.68 v36.51,57.68 | R22.1 14.87,52.94 v14.87,57.62 | v25,60.28 30.87,60.28 32.23,58.92 v32.23,58.9
  Bottom 0.2: v14.87,57.62 15.37,58.12 22.85,58.12 v25,60.28 | v36.51,57.68 35.87,58.33 35.01,58.33 34.44,58.9 v32.23,58.9
MOTOR_PAR_UP  (via drill 0.35)
  Top 0.2: STM32F401.25 50.25,60.99 46.37,64.88 43.07,64.88 41.75,63.56 41.75,63.37 38,59.62 v37,59.62 | v25.82,61.09 26.17,60.74 32.98,60.74 v34.06,59.66 | R23.2 3.57,59.94 14.05,59.94 v14.87,59.12
  Bottom 0.2: v25.82,61.09 25.68,60.95 16.7,60.95 v14.87,59.12 | v34.06,59.66 34.85,60.45 36.17,60.45 v37,59.62
MOTOR_SKIRT_CLOSE  (via drill 0.35)
  Top 0.2: STM32F401.28 48.75,60.8 45.87,63.68 43.56,63.68 42.95,63.06 42.95,62.63 37.97,57.65 37.97,56.35 v37.87,56.25 | v33.86,52.15 33.78,52.15 R28.1
  Bottom 0.2: v37.87,56.25 37.87,56.06 33.96,52.15 v33.86,52.15
MOTOR_SKIRT_OPEN  (via drill 0.35)
  Top 0.2: STM32F401.27 49.25,60.86 46.04,64.08 43.4,64.08 42.55,63.22 42.55,62.88 37.19,57.53 v37.19,56.93 | v29.01,58.11 29.01,58.32 28.32,59 25.81,59 25.61,58.8 21.93,58.8 R29.2
  Bottom 0.2: v37.19,56.93 37.13,56.93 35.99,55.79 31.33,55.79 v29.01,58.11
N$1
  Top 0.2: R31.1 43.3,57.77 SI2301.1 43.55,58.02 43.55,58.03 44.12,58.6 46.33,58.6 R30.2
N$2
  Top 0.2: 2.15,20.42 2.15,21.32 R15.2 | SI2301.7.1 2.85,20.42 2.15,20.42 | 2.15,20.42 2.15,17.22 R11.2
N$3
  Top 0.2: R18.2 13.77,57.61 13.77,54.47 | R22.2 13.77,53.54 13.77,54.47 | SI2301.4.1 13.77,54.47
N$4
  Top 0.2: SI2301.6.1 18.5,39.17 R34.2 R33.2
N$5  (via drill 0.45)
  Top 0.5: U$12.2 8.63,56.05 v8.24,55.65 | JP3.1 JP4.2
  Bottom 0.5: v8.24,55.65 7.88,55.65 6.21,53.99 6.21,51.49 JP3.1
N$6  (via drill 0.45)
  Top 0.5: U$16.2 7.37,17.99 v9.16,19.78 | JP2.1 24.5,21.87 v17.28,21.87
  Bottom 0.5: v9.16,19.78 15.19,19.78 v17.28,21.87
N$7  (via drill 0.45)
  Top 0.5: U$16.6 8.7,22.88 v8.7,21.32 | JP2.2 25.98,22.89 v16.27,22.89
  Bottom 0.5: v16.27,22.89 10.27,22.89 v8.7,21.32
N$8
  Top 0.2: R14.2 R16.1 13.69,18.29 SI2301.8.1
N$9  (via drill 0.45)
  Top 0.5: U$12.6 7.37,53.35 v7.09,53.62 | JP4.1 JP3.2
  Bottom 0.5: JP3.2 7.09,49.87 v7.09,53.62
N$10
  Top 0.2: Q24.P$3 61.48,45.39 60.32,45.39 C8.2
N$11
  Top 0.2: R21.2 R23.1 2.3,56.57 SI2301.5.1
N$12
  Top 0.2: C11.1 47.75,54.72 STM32F401.30
N$13
  Top 0.2: 5V.1 55.6,57.62 | 55.6,57.62 3V3.2 | R17.1 53.25,57.62 55.6,57.62
N$14
  Top 0.2: R24.2 31.77,55.71 31.77,52.62 | R28.2 31.77,51.84 31.77,52.62 | SI2301.2.1 31.25,52.62 31.77,52.62
N$17
  Top 0.2: R27.2 R29.1 20.3,55.07 SI2301.3.1
N$20
  Top 0.5: BUZZER.P$2 44.4,62.22 SI2301.3
N$36
  Top 0.2: R3.2 PWR.C
N$37
  Top 0.2: PC13.C R4.2
NRF_IRQ  (via drill 0.35)
  Top 0.2: v54,48.69 54.32,48.37 STM32F401.11 | v34,60.92 33.7,61.22 29.17,61.22 JP7.5
  Bottom 0.2: v54,48.69 54.6,49.29 54.6,59.52 50.1,64.02 37.1,64.02 v34,60.92
NRST  (via drill 0.35)
  Top 0.2: JP1.5 18.85,31.27 20.5,29.62 34.19,29.62 v36.09,31.53 | C9.2 57.5,46.37 STM32F401.7 55.31,46.37 55.05,46.11 55.05,39.62 54.55,39.12 50.5,39.12 46.88,35.5 46.88,34.74 42.06,29.92 v42,29.92
  Bottom 0.2: v42,29.92 41.1,29.02 38.6,29.02 v36.09,31.53
PHOTORES
  Top 0.2: STM32F401.23 51.25,54.62 | 51.25,54.62 51.25,61.14 PHOTORES.P$2 | R17.2 51.95,54.62 51.25,54.62
POWER_SKIRT_CLOSE  (via drill 0.35)
  Top 0.5: v28.04,58.32 27.92,58.19 27.36,58.19 26.64,57.47 U$17.2
  Bottom 0.5: v28.04,58.32 31.37,61.65 32.42,61.65 JP7.8
POWER_SKIRT_OPEN  (via drill 0.35)
  Top 0.5: v27.2,55.08 25.36,53.25 U$17.6
  Bottom 0.5: v27.2,55.08 27.22,55.1 27.22,58.99 JP7.7
SCK  (via drill 0.35)
  Top 0.2: LSM6DS3.P$4 50.3,27.63 LIS3MDL.P$3 | STM32F401.34 45.71,50.37 48.69,47.39 v48.69,44.12 | v18.82,15.95 16.61,13.74 JP6.1
  Bottom 0.2: LSM6DS3.P$4 48.16,30.76 48.16,43.62 48.69,44.15 v48.69,44.12 | LIS3MDL.P$3 47.71,20.02 35.21,20.02 30.86,15.67 19.1,15.67 v18.82,15.95
SCL
  Top 0.2: STM32F401.58 51.25,45.79 45.71,51.33 37.84,51.33 R37.1 36.16,52.67 32.6,56.23 32.6,57.46 30.24,59.82 30.24,59.84 25.52,59.84 25.28,59.6 24.72,59.6 24.32,60 24.32,63.53 JP7.4
  Bottom 0.2: JP7.4 22.01,61.4 15.98,61.4 13.18,58.59 13.18,55.74 9.65,52.21 9.65,45.63 JP1.16
SDA  (via drill 0.35)
  Top 0.2: STM32F401.59 51.75,46.26 46.27,51.73 39.54,51.73 R36.1 37.7,53.57 35.83,53.57 33,56.4 v33,58.12 | v30.99,58.11 29.71,59.4 29.71,59.41 25.66,59.41 25.45,59.2 24.55,59.2 21.69,62.06 JP7.3
  Bottom 0.2: JP7.3 21.69,61.82 21.67,61.8 15.42,61.8 7.82,54.2 7.82,44.02 10.41,41.43 JP1.14 | v33,58.12 v32.99,58.11 v30.99,58.11
SDIO_CK  (via drill 0.35)
  Top 0.2: STM32F401.53 48.75,39.84 38.5,29.59 38.5,22.19 v38.77,21.92 | v42.17,21.57 42.17,21.56 43.14,20.58 MICROSD.CLK
  Bottom 0.2: v42.17,21.57 41.82,21.92 v38.77,21.92
SDIO_CMD
  Top 0.2: MICROSD.CMD 41.37,18.99 | 41.37,18.99 42.69,17.67 54.7,17.67 R8.1 | STM32F401.54 49.25,39.68 38.9,29.33 38.9,22.97 39.16,22.71 40.45,20.3 41.37,18.99
SDIO_DAT0  (via drill 0.35)
  Top 0.2: R9.1 54.45,21.02 52.71,19.28 47.21,19.28 MICROSD.DAT0 44.5,21.99 44.5,22.12 43.73,22.89 43.73,26.33 42.93,27.12 42.11,27.12 40.79,28.44 40.79,29.23 v40.32,29.7 | v39.8,48.35 40.07,48.62 42.12,48.62 42.87,47.87 STM32F401.39
  Bottom 0.2: v39.8,48.35 40.52,47.63 40.52,29.7 v40.32,29.7
SDIO_DAT1  (via drill 0.35)
  Top 0.2: R10.1 52.51,19.68 48.34,19.68 MICROSD.DAT1 45.85,22.28 44.13,23.99 44.13,26.49 43.06,27.56 42.24,27.56 41.19,28.61 v41.19,30.58 | v41.3,47.92 42.25,47.92 42.8,47.37 STM32F401.40
  Bottom 0.2: v41.3,47.92 41.2,47.82 v41.2,30.59 v41.19,30.58
SDIO_DAT2
  Top 0.2: R2.1 55.85,14.62 42.67,14.62 MICROSD.DAT2 37.7,19.6 37.7,29.92 47.75,39.97 STM32F401.51
SDIO_DAT3
  Top 0.2: R7.1 55.55,17.22 41.61,17.22 MICROSD.DAT3 38.1,20.73 38.1,29.75 48.25,39.91 STM32F401.52
STATE  (via drill 0.35)
  Top 0.2: JP1.1 15.11,26.19 17.36,23.94 21.08,23.94 v21.1,23.92 | STM32F401.41 39.68,46.87 v39.5,47.05
  Bottom 0.2: v21.1,23.92 27.09,29.92 32.32,29.92 37.01,34.6 37.01,41.1 35.69,42.42 35.69,44.25 38.48,47.05 v39.5,47.05
SVC
  Top 0.2: JP1.19 12.37,47.57 10.87,47.57 10.25,46.95 10.25,46.07 10.87,45.45 14.67,45.45 15.1,45.03 33.09,45.03 37.35,40.77 41.27,40.77 42.12,41.62 R6.1 46.75,41.62 STM32F401.49
SVD
  Top 0.2: JP1.17 14.18,46.51 15.26,45.43 33.34,45.43 35.7,43.07 37.9,43.07 R5.1 39.35,44.52 43.02,44.52 43.17,44.37 STM32F401.46
TCXO
  Top 0.2: STM32F401.5 57.9,45.37 C8.1
USIL_ON  (via drill 0.35)
  Top 0.2: v60.2,37.12 v57.5,37.12 | v54.37,40.07 54.35,40.05 53.8,40.05 53.25,40.59 STM32F401.62
  Bottom 0.2: JP6.6 31.31,13.62 49.22,13.62 59.92,24.33 59.92,36.84 v60.2,37.12 | v57.5,37.12 57.32,37.12 v54.37,40.07
V_BAT
  Top 0.5: DC-DC_3V3.P$1 DC-DC_3V3.P$2
  Bottom 0.8: DC-DC_5V.P$2 DC-DC_5V.P$1 16.95,35.79 15.5,37.24 15.5,38.89 | DC-DC_3V3.P$2 15.5,55.4 15.5,38.89 | JP1.11 15.5,38.89

### Text on the board
tPlace: KO | PSK / OP | PSK / CL | G RX | G TX | SDA | SCL | N IRQ | FB SK | DBG_TX | |SVC | DBG_RX | |SVD | SCL | |3V3 | SDA | |GND | BT_PAR_DW | |V_BAT | BT_PAR_UP | |BT_DA_DW | BT_SK_CL | |BT_DA_UP | CS_LIS | BT_SK_OP | |NRST | MOSI | SCK | GND | 3V3 | FB_DA | |FB_SKIRT | MISO | CS_LIS | STATE | MISO | MOSI | GND | 3V3 | SCK | MOT DA | SCK | MISO | MOSI | CS_NRF | CE_NRF | USIL_ON | GND | 5V | GND
bPlace: ↑MOT PAR | ↓MOT PAR
tNames: PH5V | PH3V3 | +Z
bNames: FFC to ESP32-CAM | +Z